# Altium project Manipulador.PrjPcb
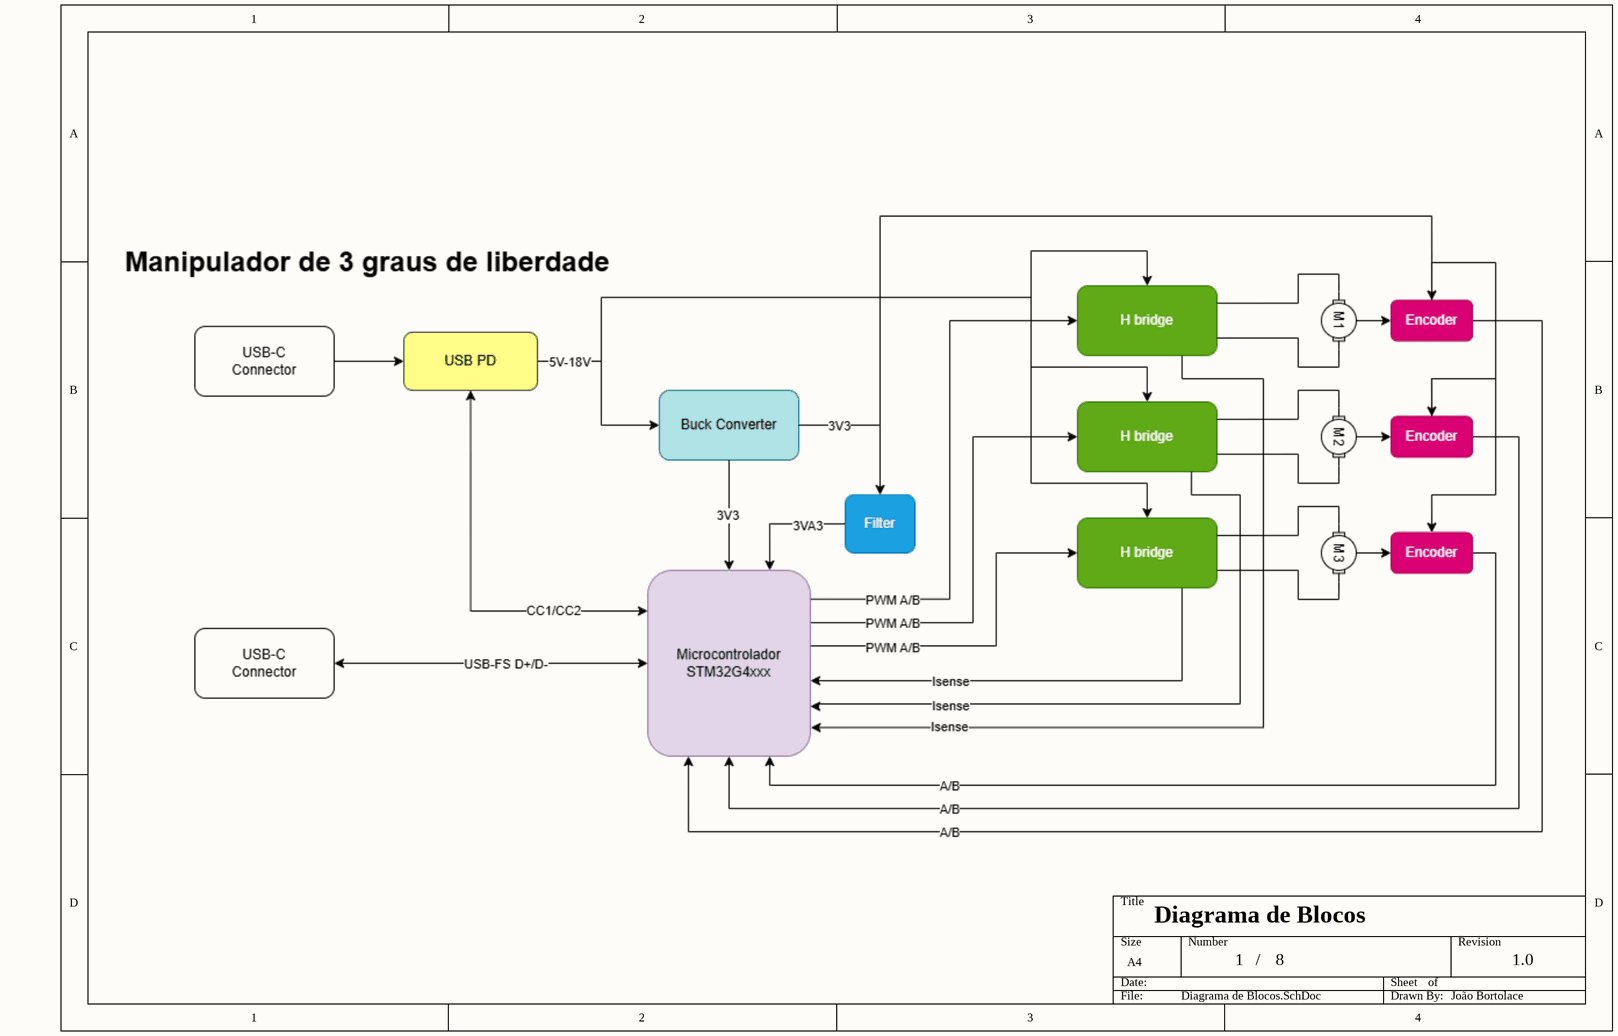
[diagram p0: Diagrama de Blocos.SchDoc]
6 sheets, 124 parts. Net scope: hierarchical (ports join the sheet entries above them; power ports are global).
Board file: Manipulador.PcbDoc
Sheets:
  Diagrama de Blocos.SchDoc
  Esquemático Principal.SchDoc
    PWR = Alimentação.SchDoc
    MCU = Microcontrolador.SchDoc
    M1 = Controle do Motor.SchDoc
    DATA = Conectores.SchDoc
    M2 = Controle do Motor.SchDoc
    M3 = Controle do Motor.SchDoc

## Sheet Diagrama de Blocos.SchDoc: Diagrama de Blocos
size A4; DrawnBy: João Bortolace; Revision: 1.0; SheetNumber: 1; SheetTotal: 8

### Notes on the sheet
- /

## Sheet Esquemático Principal.SchDoc: Esquemático Principal
size A4; DrawnBy: João Bortolace; Revision: 1.0; SheetNumber: 2; SheetTotal: 6
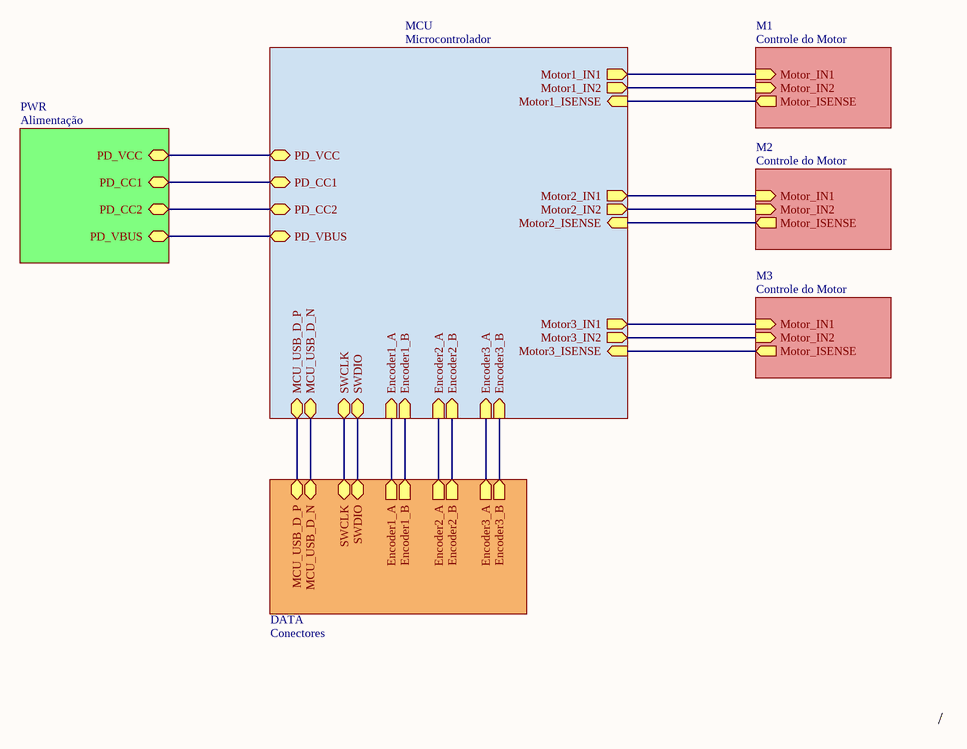
[diagram p1: Esquemático Principal.SchDoc]

### Sub-sheets
DATA = Conectores: MCU_USB_D_P (bidir), MCU_USB_D_N (bidir), SWCLK (bidir), SWDIO (bidir), Encoder1_A (out), Encoder1_B (out), Encoder2_B (out), Encoder2_A (out), Encoder3_A (out), Encoder3_B (out)
M1 = Controle do Motor: Motor_IN1 (in), Motor_IN2 (in), Motor_ISENSE (out)
M2 = Controle do Motor: Motor_IN1 (in), Motor_IN2 (in), Motor_ISENSE (out)
M3 = Controle do Motor: Motor_IN1 (in), Motor_IN2 (in), Motor_ISENSE (out)
MCU = Microcontrolador: PD_CC2 (bidir), PD_CC1 (bidir), PD_VCC (bidir), PD_VBUS (bidir), Motor1_IN1 (out), Motor1_IN2 (out), Motor1_ISENSE (in), Motor2_IN1 (out), Motor2_IN2 (out), Motor2_ISENSE (in), Motor3_IN1 (out), Motor3_IN2 (out), Motor3_ISENSE (in), MCU_USB_D_P (bidir), MCU_USB_D_N (bidir), Encoder1_A (in), Encoder1_B (in), Encoder2_B (in), Encoder2_A (in), Encoder3_A (in), Encoder3_B (in), SWCLK (bidir), SWDIO (bidir)
PWR = Alimentação: PD_CC2 (bidir), PD_CC1 (bidir), PD_VBUS (bidir), PD_VCC (bidir)

### Nets
Encoder1_A: sheet MCU/Encoder1_A, sheet DATA/Encoder1_A
Encoder1_B: sheet MCU/Encoder1_B, sheet DATA/Encoder1_B
Encoder2_A: sheet MCU/Encoder2_A, sheet DATA/Encoder2_A
Encoder2_B: sheet MCU/Encoder2_B, sheet DATA/Encoder2_B
Encoder3_A: sheet MCU/Encoder3_A, sheet DATA/Encoder3_A
Encoder3_B: sheet MCU/Encoder3_B, sheet DATA/Encoder3_B
MCU_USB_D_N: sheet MCU/MCU_USB_D_N, sheet DATA/MCU_USB_D_N
MCU_USB_D_P: sheet MCU/MCU_USB_D_P, sheet DATA/MCU_USB_D_P
Motor1_IN1: sheet MCU/Motor1_IN1, sheet M1/Motor_IN1
Motor1_IN2: sheet MCU/Motor1_IN2, sheet M1/Motor_IN2
Motor1_ISENSE: sheet MCU/Motor1_ISENSE, sheet M1/Motor_ISENSE
Motor2_IN1: sheet MCU/Motor2_IN1, sheet M2/Motor_IN1
Motor2_IN2: sheet MCU/Motor2_IN2, sheet M2/Motor_IN2
Motor2_ISENSE: sheet MCU/Motor2_ISENSE, sheet M2/Motor_ISENSE
Motor3_IN1: sheet MCU/Motor3_IN1, sheet M3/Motor_IN1
Motor3_IN2: sheet MCU/Motor3_IN2, sheet M3/Motor_IN2
Motor3_ISENSE: sheet MCU/Motor3_ISENSE, sheet M3/Motor_ISENSE
PD_CC1: sheet PWR/PD_CC1, sheet MCU/PD_CC1
PD_CC2: sheet PWR/PD_CC2, sheet MCU/PD_CC2
PD_VBUS: sheet PWR/PD_VBUS, sheet MCU/PD_VBUS
PD_VCC: sheet PWR/PD_VCC, sheet MCU/PD_VCC
SWCLK: sheet MCU/SWCLK, sheet DATA/SWCLK
SWDIO: sheet MCU/SWDIO, sheet DATA/SWDIO

### Notes on the sheet
- /

## Sheet Alimentação.SchDoc: Alimentação
size A4; DrawnBy: João Bortolace; Revision: 1.0; SheetNumber: 3; SheetTotal: 6
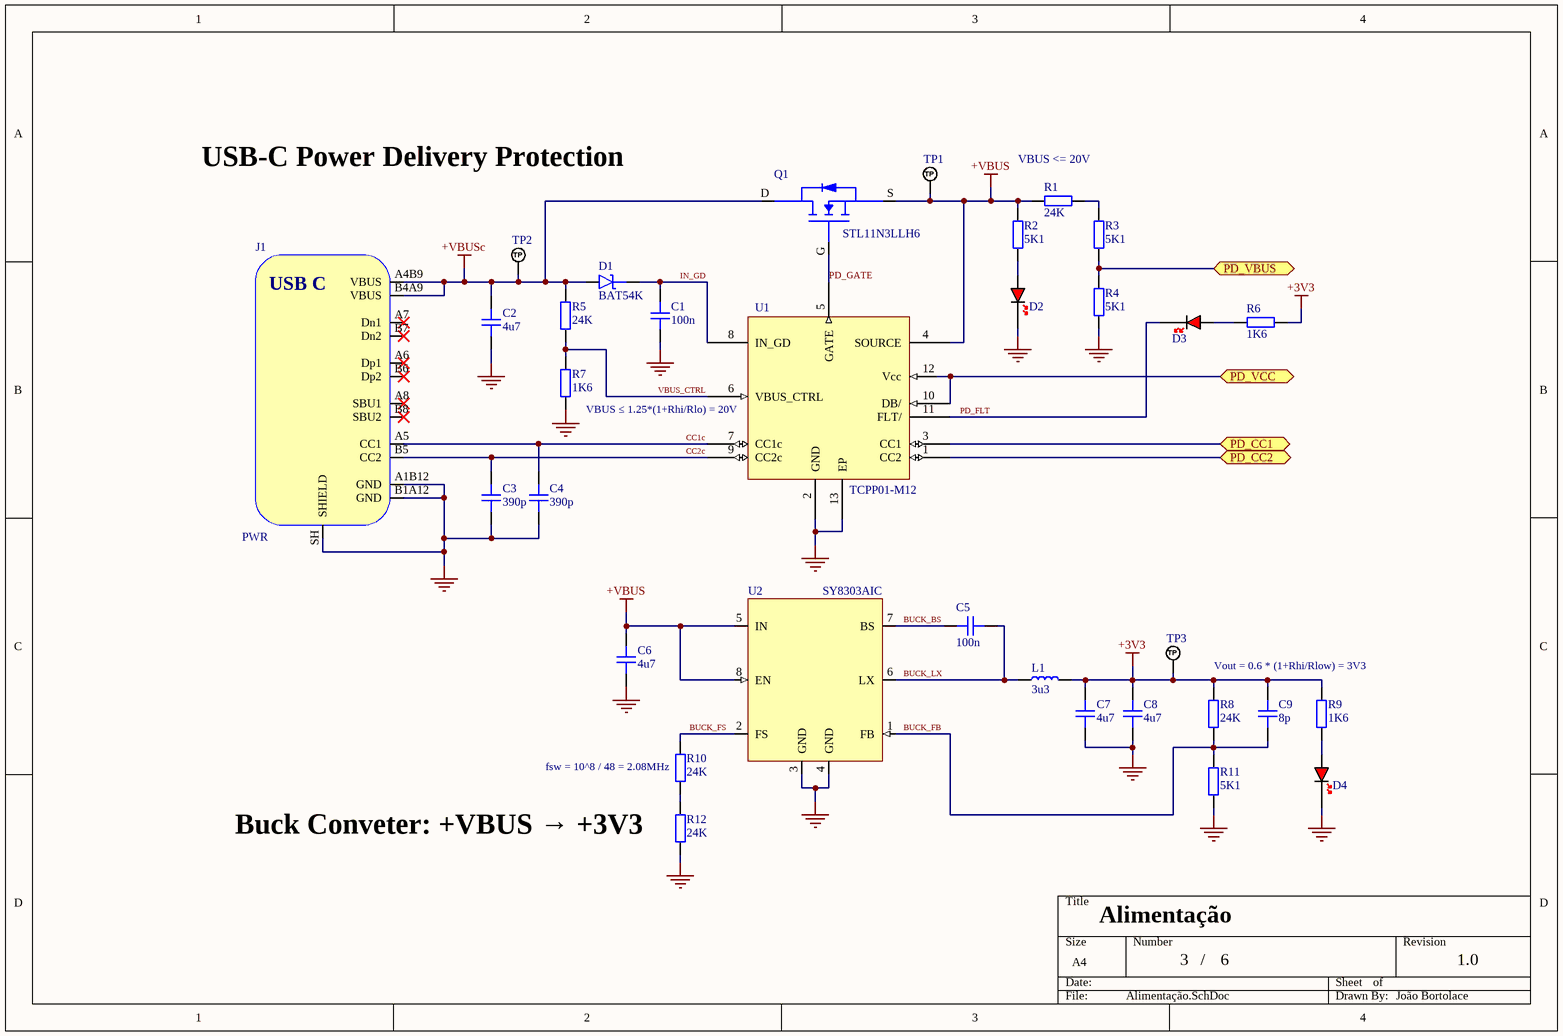
[diagram p2: Alimentação.SchDoc]

### Parts
C1  100n  [CAP_0402]
C2  4u7  [CAP_0805]
C3  390p  [CAP_0603]
C4  390p  [CAP_0603]
C5  100n  [CAP_0402]
C6  4u7  [CAP_0805]
C7  4u7  [CAP_0805]
C8  4u7  [CAP_0805]
C9  8p  [CAP_0402]
D1  BAT54K  [SOD-323]
D2  +VBUS  [LED_0402_RED]  (value not drawn)
D3  FLT  [LED_0402_RED]  (value not drawn)
D4  +3V3  [LED_0402_RED]  (value not drawn)
J1  PWR  [USB4105-GF-A-060]
L1  3u3  [SRP3212A]
Q1  STL11N3LLH6  [PowerFLAT 3.3x3.3]
R1  24K  [RES_0402]
R2  5K1  [RES_0402]
R3  5K1  [RES_0402]
R4  5K1  [RES_0402]
R5  24K  [RES_0402]
R6  1K6  [RES_0402]
R7  1K6  [RES_0402]
R8  24K  [RES_0402]
R9  1K6  [RES_0402]
R10  24K  [RES_0402]
R11  5K1  [RES_0402]
R12  24K  [RES_0402]
TP1  TP_NOBOM  [PAD_RND_1MM]  (value not drawn)  (no BOM)
TP2  TP_NOBOM  [PAD_RND_1MM]  (value not drawn)  (no BOM)
TP3  TP_NOBOM  [PAD_RND_1MM]  (value not drawn)  (no BOM)
U1  TCPP01-M12  [QFN-12L]
U2  SY8303AIC  [TSOT23-8]

### Ports
PD_CC1 (bidir, see Esquemático Principal[2B], Microcontrolador[1C]), PD_CC2 (bidir, see Esquemático Principal[2B], Microcontrolador[1B]), PD_VBUS (bidir, see Esquemático Principal[2B], Microcontrolador[3B]), PD_VCC (bidir, see Esquemático Principal[2B], Microcontrolador[1D])

### Nets
+3V3: C7.2 C8.2 C9.2 L1.2 R6.1 R8.2 R9.2 TP3.1(TP)
+VBUS: C6.2 Q1.S R1.2 R2.2 TP1.1(TP) U1.4(SOURCE) U2.5(IN) U2.8(EN)
+VBUSc: C2.2 D1.A J1.A4B9(VBUS) J1.B4A9(VBUS) Q1.D R5.2 TP2.1(TP)
GND: C1.1 C2.1 C3.1 C4.1 C6.1 C7.1 C8.1 D2.K D4.K J1.A1B12(GND) J1.B1A12(GND) J1.SH(SHIELD) R4.1 R7.1 R11.1 R12.1 U1.2(GND) U1.13(EP) U2.3(GND) U2.4(GND)
BUCK_BS: C5.1 U2.7(BS)
BUCK_FB: C9.1 R8.1 R11.2 U2.1(FB)
BUCK_FS: R10.2 U2.2(FS)
BUCK_LX: C5.2 L1.1 U2.6(LX)
CC1c: C4.2 J1.A5(CC1) U1.7(CC1c)
CC2c: C3.2 J1.B5(CC2) U1.9(CC2c)
IN_GD: C1.2 D1.K U1.8(IN_GD)
PD_CC1: U1.3(CC1) ; port PD_CC1
PD_CC2: U1.1(CC2) ; port PD_CC2
PD_FLT: D3.K U1.11(FLT/)
PD_GATE: Q1.G U1.5(GATE)
PD_VBUS: R3.2 R4.2 ; port PD_VBUS
PD_VCC: U1.10(DB/) U1.12(Vcc) ; port PD_VCC
VBUS_CTRL: R5.1 R7.2 U1.6(VBUS_CTRL)
NetD2_A: D2.A R2.1
NetD3_A: D3.A R6.2
NetD4_A: D4.A R9.1
NetR1_1: R1.1 R3.1
NetR10_1: R10.1 R12.2

Not connected (* = marked no-connect by the designer): J1 A6(Dp1)* A7(Dn1)* A8(SBU1)* B6(Dp2)* B7(Dn2)* B8(SBU2)*

### Notes on the sheet
- USB-C Power Delivery Protection
- VBUS <= 20V
- (near U1) VBUS ≤ 1.25*(1+Rhi/Rlo) = 20V
- Vout = 0.6 * (1+Rhi/Rlow) = 3V3
- (near R10) fsw = 10^8 / 48 = 2.08MHz
- Buck Conveter: +VBUS → +3V3
- /
- (in symbol USB4105-GF-A-060) USB C

### Library data of the parts
C1 C5 = CAP_0402: 100nF ±10% 50V Ceramic Capacitor X7R 0402D 0402; Manufacturer: muRata; Manufacturer Part Number: GRM155R71H104KE14D; Distributor Link: https://www.lcsc.com/product-detail/C77020.html; LCSC: C77020; Rating: *; Dielectric: *
C2 C6-C8 = CAP_0805: 4.7uF ±10% 50V Ceramic Capacitor X5R 0805; Manufacturer: Samsung Electro-Mechanics; Manufacturer Part Number: CL21A475KBQNNNE; Distributor Link: https://www.lcsc.com/product-detail/C98192.html?s_z=n_capacitor%25204.7u; LCSC: C98192; Rating: *; Dielectric: *
C3 C4 = CAP_0603: 390pF ±5% 50V Ceramic Capacitor C0G 0603; Manufacturer: muRata; Manufacturer Part Number: GRM1885C1H391JA01D; Distributor Link: https://www.lcsc.com/product-detail/C701309.html?s_z=n_C701309; LCSC: C701309; Rating: 50V; Dielectric: C0G
C9 = CAP_0402: 8pF ±1% 50V Ceramic Capacitor C0G 0402; Manufacturer: muRata; Manufacturer Part Number: GCM1555C1H8R0FA16D; Distributor Link: https://www.lcsc.com/product-detail/C1864375.html?utm_source=octopart&utm_medium=cpc&utm_campaign=GCM1555C1H8R0FA16D; LCSC: C1864375; Rating: 50V; Dielectric: C0G
D1 = D_SCHOTTKY_SOD_323: Diode Schottky SMD SOD-323; Manufacturer: STMicroelectronics; Manufacturer Part Number: BAT54KFILM; Part Link: https://www.lcsc.com/product-detail/C283259.html?s_z=n_BAT54K; LCSC: C283259
D2-D4 = LED_0402_RED: LED 0402 RED SMD
J1 = USB4105-GF-A-060: USB-C (USB TYPE-C) Receptacle Connector 16 Position Surface Mount, Right Angle; Manufacturer: DEALON; Manufacturer Part Number: USB-TYPE-C-018; Part Link: https://www.lcsc.com/product-detail/C2927038.html?s_z=n_usb%2520type%2520c; LCSC: C2927038
L1 = SRP3212A-*: Inductor 3u3 3.4A  87mΩ 1210 Fixed Inductors RoHS; Manufacturer: Bourns; Manufacturer Part Number: SRP3212A-3R3M; Distributor Link: https://www.lcsc.com/product-detail/C19779117.html?s_z=n_SRP3212A-%2a; LCSC: C19779117
Q1 = STL11N3LLH6: Mosfet N-channel 30 V, 6 mΩ typ., 11 A; Manufacturer: STMicroelectronics; Manufacturer Part Number: STL11N3LLH6; Part Link: https://www.mouser.com/ProductDetail/STMicroelectronics/STL11N3LLH6?qs=CBOTe0%252BbgkbnVaR%2FX25%2FKw%3D%3D; LCSC: C2965326
R1-R12 = RES_0402: Resistor SMD 0402; Manufacturer: *; Manufacturer Part Number: *; Distributor Link: *; LCSC: *
TP1-TP3 = TEST_POINT_RND_1MM: Test Point Round 1mm (NO BOM)
U1 = TCPP01-M12: USB Type-C™ and power delivery protection for sink application; Manufacturer: STMicroelectronics; Manufacturer Part Number: TCPP01-M12; ComponentLink1Description: Datasheet; ComponentLink1URL: *; Part Link: https://www.mouser.com/ProductDetail/STMicroelectronics/TCPP01-M12?qs=%252B6g0mu59x7KCafIwapwG2A%3D%3D; LCSC: C1121848; Mouser: 511-TCPP01-M12
U2 = SY8303AIC: High Efficiency Fast Response, 3A, 40V Input Synchronous Step Down Regulator; Manufacturer: Silergy; Manufacturer Part Number: SY8303AIC; Distributor Link: https://www.lcsc.com/product-detail/DC-DC-Converters_Silergy-Corp-SY8303AIC_C97054.html; LCSC: C97054

## Sheet Microcontrolador.SchDoc: Microcontrolador
size A4; DrawnBy: João Bortolace; Revision: 1.0; SheetNumber: 4; SheetTotal: 6
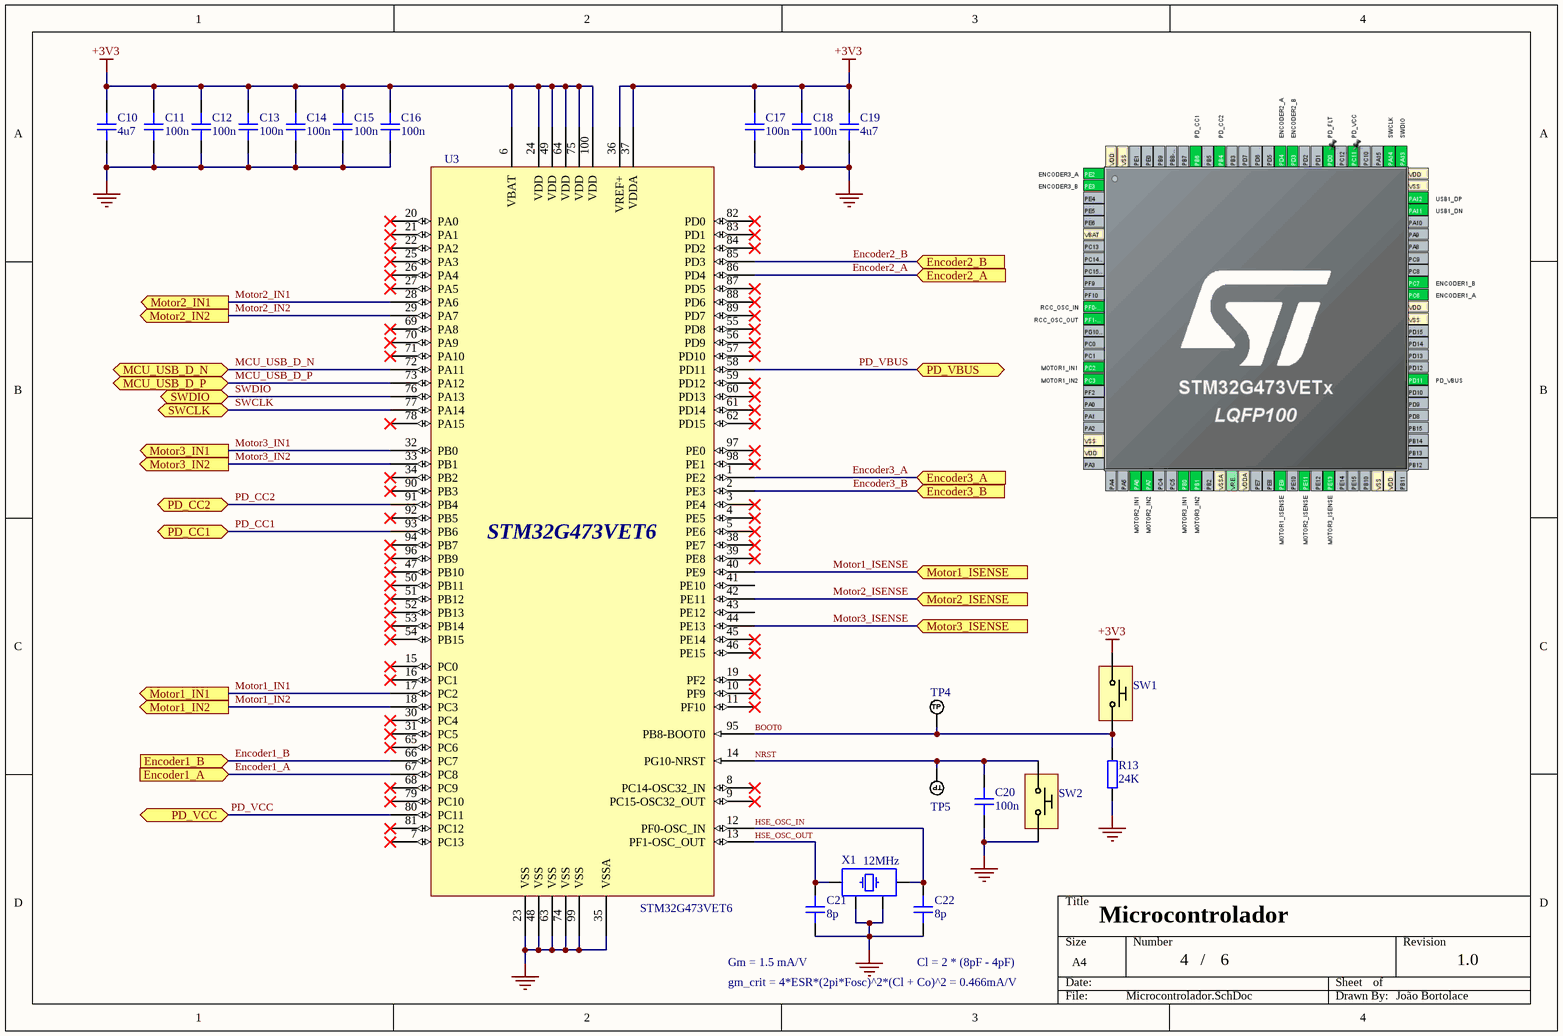
[diagram p3: Microcontrolador.SchDoc]

### Parts
C10  4u7  [CAP_0805]
C11  100n  [CAP_0402]
C12  100n  [CAP_0402]
C13  100n  [CAP_0402]
C14  100n  [CAP_0402]
C15  100n  [CAP_0402]
C16  100n  [CAP_0402]
C17  100n  [CAP_0402]
C18  100n  [CAP_0402]
C19  4u7  [CAP_0805]
C20  100n  [CAP_0402]
C21  8p  [CAP_0402]
C22  8p  [CAP_0402]
R13  24K  [RES_0402]
SW1  BOOT  [PTS815]  (value not drawn)
SW2  RST  [PTS815]  (value not drawn)
TP4  TP_NOBOM  [PAD_RND_1MM]  (value not drawn)  (no BOM)
TP5  TP_NOBOM  [PAD_RND_1MM]  (value not drawn)  (no BOM)
U3  STM32G473VET6  [LQFP100]
X1  12MHz  [XTAL_3225]

### Ports
Encoder1_A (in, see Esquemático Principal[2C], Conectores[1C]), Encoder1_B (in, see Esquemático Principal[2C], Conectores[1D]), Encoder2_A (in, see Esquemático Principal[2C], Conectores[2C]), Encoder2_B (in, see Esquemático Principal[2C], Conectores[2D]), Encoder3_A (in, see Esquemático Principal[2C], Conectores[3C]), Encoder3_B (in, see Esquemático Principal[2C], Conectores[3D]), MCU_USB_D_N (bidir, see Esquemático Principal[2C], Conectores[3B]), MCU_USB_D_P (bidir, see Esquemático Principal[2C], Conectores[3B]), Motor1_IN1 (out, see Esquemático Principal[3B]), Motor1_IN2 (out, see Esquemático Principal[3B]), Motor1_ISENSE (in, see Esquemático Principal[3B]), Motor2_IN1 (out, see Esquemático Principal[3B]), Motor2_IN2 (out, see Esquemático Principal[3B]), Motor2_ISENSE (in, see Esquemático Principal[3B]), Motor3_IN1 (out, see Esquemático Principal[3C]), Motor3_IN2 (out, see Esquemático Principal[3C]), Motor3_ISENSE (in, see Esquemático Principal[3C]), PD_CC1 (bidir, see Esquemático Principal[2B], Alimentação[4B]), PD_CC2 (bidir, see Esquemático Principal[2B], Alimentação[4B]), PD_VBUS (bidir, see Esquemático Principal[2B], Alimentação[4B]), PD_VCC (bidir, see Esquemático Principal[2B], Alimentação[4B]), SWCLK (bidir, see Esquemático Principal[2C], Conectores[3B]), SWDIO (bidir, see Esquemático Principal[2C], Conectores[3B])

### Nets
+3V3: C10.2 C11.2 C12.2 C13.2 C14.2 C15.2 C16.2 C17.2 C18.2 C19.2 SW1.1 U3.6(VBAT) U3.24(VDD) U3.36(VREF+) U3.37(VDDA) U3.49(VDD) U3.64(VDD) U3.75(VDD) U3.100(VDD)
GND: C10.1 C11.1 C12.1 C13.1 C14.1 C15.1 C16.1 C17.1 C18.1 C19.1 C20.1 C21.1 C22.1 R13.1 SW2.2 U3.23(VSS) U3.35(VSSA) U3.48(VSS) U3.63(VSS) U3.74(VSS) U3.99(VSS) X1.2 X1.4
BOOT0: R13.2 SW1.2 TP4.1(TP) U3.95(PB8-BOOT0)
Encoder1_A: U3.67(PC8) ; port Encoder1_A
Encoder1_B: U3.66(PC7) ; port Encoder1_B
Encoder2_A: U3.86(PD4) ; port Encoder2_A
Encoder2_B: U3.85(PD3) ; port Encoder2_B
Encoder3_A: U3.1(PE2) ; port Encoder3_A
Encoder3_B: U3.2(PE3) ; port Encoder3_B
HSE_OSC_IN: C22.2 U3.12(PF0-OSC_IN) X1.3
HSE_OSC_OUT: C21.2 U3.13(PF1-OSC_OUT) X1.1
MCU_USB_D_N: U3.72(PA11) ; port MCU_USB_D_N
MCU_USB_D_P: U3.73(PA12) ; port MCU_USB_D_P
Motor1_IN1: U3.17(PC2) ; port Motor1_IN1
Motor1_IN2: U3.18(PC3) ; port Motor1_IN2
Motor1_ISENSE: U3.40(PE9) ; port Motor1_ISENSE
Motor2_IN1: U3.28(PA6) ; port Motor2_IN1
Motor2_IN2: U3.29(PA7) ; port Motor2_IN2
Motor2_ISENSE: U3.42(PE11) ; port Motor2_ISENSE
Motor3_IN1: U3.32(PB0) ; port Motor3_IN1
Motor3_IN2: U3.33(PB1) ; port Motor3_IN2
Motor3_ISENSE: U3.44(PE13) ; port Motor3_ISENSE
NRST: C20.2 SW2.1 TP5.1(TP) U3.14(PG10-NRST)
PD_CC1: U3.93(PB6) ; port PD_CC1
PD_CC2: U3.91(PB4) ; port PD_CC2
PD_VBUS: U3.58(PD11) ; port PD_VBUS
PD_VCC: U3.80(PC11) ; port PD_VCC
SWCLK: U3.77(PA14) ; port SWCLK
SWDIO: U3.76(PA13) ; port SWDIO

Not connected (* = marked no-connect by the designer): U3 3(PE4)* 4(PE5)* 5(PE6)* 7(PC13)* 8(PC14-OSC32_IN)* 9(PC15-OSC32_OUT)* 10(PF9)* 11(PF10)* 15(PC0)* 16(PC1)* 19(PF2)* 20(PA0)* 21(PA1)* 22(PA2)* 25(PA3)* 26(PA4)* 27(PA5)* 30(PC4)* 31(PC5)* 34(PB2)* 38(PE7)* 39(PE8)* 41(PE10) 43(PE12) 45(PE14)* 46(PE15)* 47(PB10)* 50(PB11)* 51(PB12)* 52(PB13)* 53(PB14)* 54(PB15)* 55(PD8)* 56(PD9)* 57(PD10)* 59(PD12)* 60(PD13)* 61(PD14)* 62(PD15)* 65(PC6)* 68(PC9)* 69(PA8)* 70(PA9)* 71(PA10)* 78(PA15)* 79(PC10)* 81(PC12)* 82(PD0)* 83(PD1)* 84(PD2)* 87(PD5)* 88(PD6)* 89(PD7)* 90(PB3)* 92(PB5)* 94(PB7)* 96(PB9)* 97(PE0)* 98(PE1)*

### Notes on the sheet
- gm_crit = 4*ESR*(2pi*Fosc)^2*(Cl + Co)^2 = 0.466mA/V
- (near C21) Gm = 1.5 mA/V
- (near C22) Cl = 2 * (8pF - 4pF)
- /

### Library data of the parts
C10 C19 = CAP_0805: as C2 on sheet Alimentação; Distributor Link: https://www.lcsc.com/product-detail/C98192.html?s_z=n_capacitor%25204.7u; LCSC: C98192; Rating: *; Dielectric: *
C11-C18 C20 = CAP_0402: as C1 on sheet Alimentação; Distributor Link: https://www.lcsc.com/product-detail/C77020.html; LCSC: C77020; Rating: *; Dielectric: *
  C17: Supplier: LCSC; Supplier Part Number: C730122
C21 C22 = CAP_0402: as C9 on sheet Alimentação; Distributor Link: https://www.lcsc.com/product-detail/C1864375.html?utm_source=octopart&utm_medium=cpc&utm_campaign=GCM1555C1H8R0FA16D; LCSC: C1864375; Rating: 50V; Dielectric: C0G
R13 = RES_0402: Resistor SMD 0402; Manufacturer: *; Manufacturer Part Number: *; Distributor Link: *; LCSC: *
SW1 SW2 = PTS815-SJM-250-SMTR-LFS: Tactile Switch SPST 400gf 2.5mm 4.2mm x 3.2mm Surface Mount; Manufacturer: G-Switch; Manufacturer Part Number: GT-TC048D-H025-L1; LCSC: C843674
TP4 TP5 = TEST_POINT_RND_1MM: Test Point Round 1mm (NO BOM)
U3 = STM32G473VET6: Arm Cortex-M4 32-bit MCU+FPU, up to 512 KB Flash, 170 MHz / 213DMIPS, 128KB SRAM, rich analog, math accelerator; Manufacturer: STMicroelectronics; Manufacturer Part Number: STM32G473VET6; Part Link: https://www.lcsc.com/product-detail/C730122.html?s_z=n_C730122; LCSC: C730122; Supplier: Avnet; Supplier Part Number: STM32G473VET6
X1 = TSX-3225_24.0000MF15X-AC: Crystal 12MHz ±15ppm 8pF 120Ω SMD3225-4P; Manufacturer: DIODES; Manufacturer Part Number: FL1200138; LCSC: C526612; Part Link: https://www.lcsc.com/product-detail/C526612.html?s_z=n_Crystal%252012MHz%2520%25C2%25B110ppm%25208pF%2520120%25CE%25A9%2520SMD3225-4P; Supplier: LCSC; Supplier Part Number: C730122

## Sheet Controle do Motor.SchDoc: Controle do Motor
size A4; DrawnBy: João Bortolace; Revision: 1.0; SheetNumber: 5; SheetTotal: 6
Used 3 times, as channels M1, M2, M3. Parts and nets are listed once, with the designators drawn on the sheet.
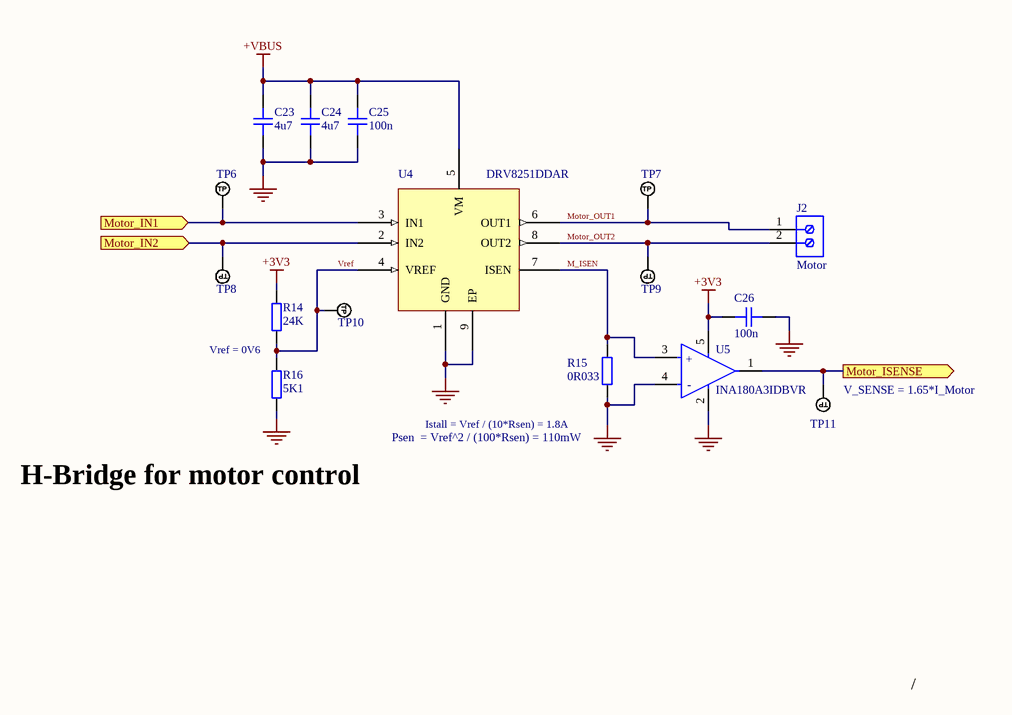
[diagram p4: Controle do Motor.SchDoc]

### Parts
C23  4u7  [CAP_0805]
C24  4u7  [CAP_0805]
C25  100n  [CAP_0402]
C26  100n  [CAP_0402]
J2  Motor  [691102710002]  (no BOM)
R14  24K  [RES_0402]
R15  0R033  [RES_1206]
R16  5K1  [RES_0402]
TP6  TP_NOBOM  [PAD_RND_1MM]  (value not drawn)  (no BOM)
TP7  TP_NOBOM  [PAD_RND_1MM]  (value not drawn)  (no BOM)
TP8  TP_NOBOM  [PAD_RND_1MM]  (value not drawn)  (no BOM)
TP9  TP_NOBOM  [PAD_RND_1MM]  (value not drawn)  (no BOM)
TP10  TP_NOBOM  [PAD_RND_1MM]  (value not drawn)  (no BOM)
TP11  TP_NOBOM  [PAD_RND_1MM]  (value not drawn)  (no BOM)
U4  DRV8251DDAR  [HSOP8]
U5  INA180A3IDBVR  [FP-DBV0005A-MFG]

### Ports
Motor_IN1 (in, see Esquemático Principal[3B]), Motor_IN2 (in, see Esquemático Principal[3B]), Motor_ISENSE (out, see Esquemático Principal[3B])

### Nets
+3V3: C26.2 R14.2 U5.5(VS)
+VBUS: C23.2 C24.2 C25.2 U4.5(VM)
GND: C23.1 C24.1 C25.1 C26.1 R15.1 R16.1 U4.1(GND) U4.9(EP) U5.2(GND) U5.4(IN-)
M_ISEN: R15.2 U4.7(ISEN) U5.3(IN+)
Motor_IN1: TP6.1(TP) U4.3(IN1) ; port Motor_IN1
Motor_IN2: TP8.1(TP) U4.2(IN2) ; port Motor_IN2
Motor_ISENSE: TP11.1(TP) U5.1(OUT) ; port Motor_ISENSE
Motor_OUT1: J2.1 TP7.1(TP) U4.6(OUT1)
Motor_OUT2: J2.2 TP9.1(TP) U4.8(OUT2)
Vref: R14.1 R16.2 TP10.1(TP) U4.4(VREF)

### Channels
M1: designators end in A; ports Motor_IN1=Motor1_IN1 Motor_IN2=Motor1_IN2 Motor_ISENSE=Motor1_ISENSE
M2: designators end in B; ports Motor_IN1=Motor2_IN1 Motor_IN2=Motor2_IN2 Motor_ISENSE=Motor2_ISENSE
M3: designators end in C; ports Motor_IN1=Motor3_IN1 Motor_IN2=Motor3_IN2 Motor_ISENSE=Motor3_ISENSE

### Notes on the sheet
- Vref = 0V6
- (near R15) Psen  = Vref^2 / (100*Rsen) = 110mW
- (near R15) Istall = Vref / (10*Rsen) = 1.8A
- (near TP11) V_SENSE = 1.65*I_Motor
- H-Bridge for motor control
- /
- (in symbol CMP-04895-000229-1) +; -

### Library data of the parts
C23 C24 = CAP_0805: as C2 on sheet Alimentação; Distributor Link: https://www.lcsc.com/product-detail/C98192.html?s_z=n_capacitor%25204.7u; LCSC: C98192; Rating: *; Dielectric: *
C25 C26 = CAP_0402: as C1 on sheet Alimentação; Distributor Link: https://www.lcsc.com/product-detail/C77020.html; LCSC: C77020; Rating: *; Dielectric: *
J2 = CMP-1502-03258-3: 102 Series 5MM Pitch Straight, Pcb Terminal Block, Through Hole, 2 Way; Current Rating: 15A; Wire/Cable Gauge: 22AWG; Voltage: 300V; Number of Positions Per Level: 2; Plating: Steel; Stripping Length: -6mm; Wire Gauge (Min): 14AWG; Number of Levels: 1; Pitch: 5.0038mm; Width: 11.2mm; Max Operating Temperature: 105°C; Contact Material: Brass; Contact Plating: Tin; Current: 15A; Wire Gauge (Max): 22AWG; Mount: Through Hole; Length: 7.5mm; Min Operating Temperature: -40°C; RoHS: Compliant; Color: Blue; Number of Pins: 2; Housing Material: Nylon; Termination: Screw; Height: 13.4mm; Number of Contacts: 2; Lead Pitch: 5mm; Voltage Rating: 300V; Packaging: Box
R14 R16 = RES_0402: Resistor SMD 0402; Manufacturer: *; Manufacturer Part Number: *; Distributor Link: *; LCSC: *
R15 = RES_1206: 250mW 33mΩ Thick Film Resistor ±1200ppm/℃ ±1% 1206 Chip Resistor - Surface Mount RoHS; Manufacturer: FOJAN; Manufacturer Part Number: FRL1206FR033TS; Distributor Link: https://www.lcsc.com/product-detail/C7467307.html?s_z=n_33m%25CE%25A9%2520; LCSC: C7467307
TP6-TP11 = TEST_POINT_RND_1MM: Test Point Round 1mm (NO BOM)
U4 = DRV8251: 4.1-A Brushed DC Motor Driver with Integrated Current Regulation; Manufacturer: TI; Manufacturer Part Number: DRV8251DDAR; Part Link: https://www.lcsc.com/product-detail/C3681116.html?s_z=n_C3681116; LCSC: C3681116; Mouser: 595-DRV8251DDAR
U5 = CMP-04895-000229-1: IC CURR SENSE 1 CIRCUIT SOT23-5; -3db Bandwidth: 350kHz; Input Bias Current: 100nA; Input Offset Voltage (Vos): 100uV; Operating Supply Current: 260uA; Slew Rate: 2V/µs; Number of Circuits: 1; Max Operating Temperature: 125°C; Packaging: Tape and Reel; Case/Package: SOT-23-5; Mount: Surface Mount; Min Operating Temperature: -40°C; RoHS Compliant: Yes

## Sheet Conectores.SchDoc: Conectores
size A4; DrawnBy: João Bortolace; Revision: 1.0; SheetNumber: 6; SheetTotal: 6
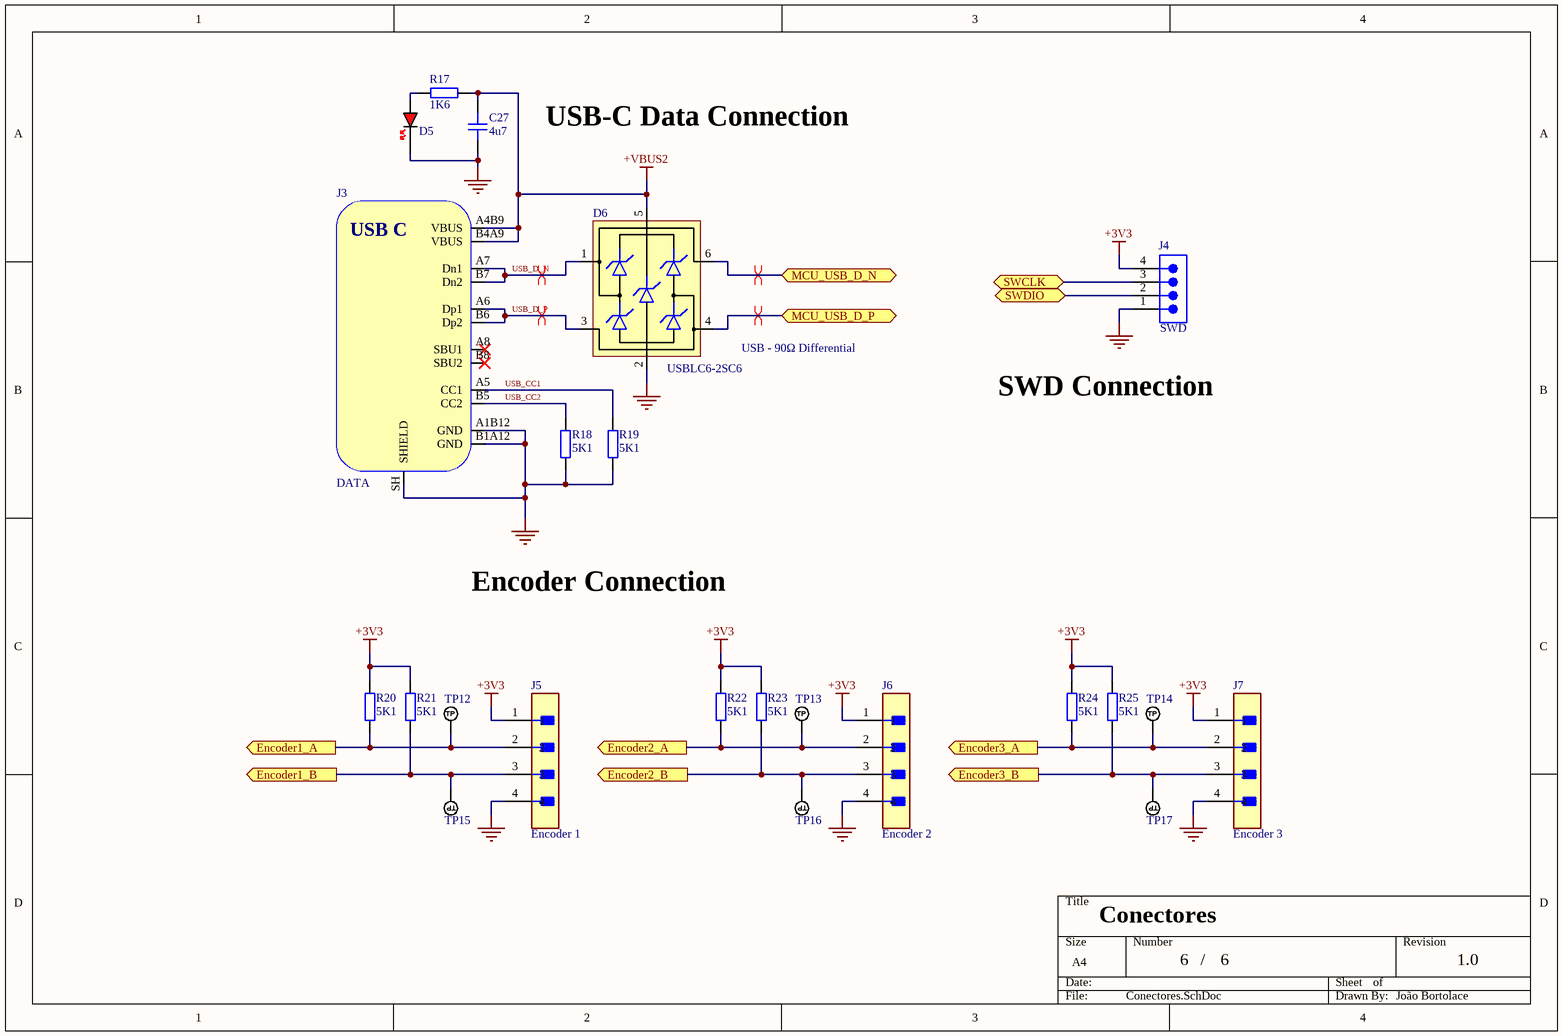
[diagram p5: Conectores.SchDoc]

### Parts
C27  4u7  [CAP_0805]
D5  USB  [LED_0402_RED]  (value not drawn)
D6  USBLC6-2SC6  [SOT-23-6]
J3  DATA  [USB4105-GF-A-060]
J4  SWD  [SMTC-PHT-104-01-X-S]  (no BOM)
J5  Encoder 1  [FP-470531000-MFG]  (no BOM)
J6  Encoder 2  [FP-470531000-MFG]  (no BOM)
J7  Encoder 3  [FP-470531000-MFG]  (no BOM)
R17  1K6  [RES_0402]
R18  5K1  [RES_0603]
R19  5K1  [RES_0603]
R20  5K1  [RES_0402]
R21  5K1  [RES_0402]
R22  5K1  [RES_0402]
R23  5K1  [RES_0402]
R24  5K1  [RES_0402]
R25  5K1  [RES_0402]
TP12  TP_NOBOM  [PAD_RND_1MM]  (value not drawn)  (no BOM)
TP13  TP_NOBOM  [PAD_RND_1MM]  (value not drawn)  (no BOM)
TP14  TP_NOBOM  [PAD_RND_1MM]  (value not drawn)  (no BOM)
TP15  TP_NOBOM  [PAD_RND_1MM]  (value not drawn)  (no BOM)
TP16  TP_NOBOM  [PAD_RND_1MM]  (value not drawn)  (no BOM)
TP17  TP_NOBOM  [PAD_RND_1MM]  (value not drawn)  (no BOM)

### Ports
Encoder1_A (out, see Esquemático Principal[2C], Microcontrolador[1D]), Encoder1_B (out, see Esquemático Principal[2C], Microcontrolador[1C]), Encoder2_A (out, see Esquemático Principal[2C], Microcontrolador[3B]), Encoder2_B (out, see Esquemático Principal[2C], Microcontrolador[3B]), Encoder3_A (out, see Esquemático Principal[2C], Microcontrolador[3B]), Encoder3_B (out, see Esquemático Principal[2C], Microcontrolador[3B]), MCU_USB_D_N (bidir, see Esquemático Principal[2C], Microcontrolador[1B]), MCU_USB_D_P (bidir, see Esquemático Principal[2C], Microcontrolador[1B]), SWCLK (bidir, see Esquemático Principal[2C], Microcontrolador[1B]), SWDIO (bidir, see Esquemático Principal[2C], Microcontrolador[1B])

### Nets
+3V3: J4.4 J5.1 J6.1 J7.1 R20.2 R21.2 R22.2 R23.2 R24.2 R25.2
+VBUS2: C27.2 D6.5(VBUS) J3.A4B9(VBUS) J3.B4A9(VBUS) R17.2
GND: C27.1 D5.K D6.2(GND) J3.A1B12(GND) J3.B1A12(GND) J3.SH(SHIELD) J4.1 J5.4 J6.4 J7.4 R18.1 R19.1
Encoder1_A: J5.2 R20.1 TP12.1(TP) ; port Encoder1_A
Encoder1_B: J5.3 R21.1 TP15.1(TP) ; port Encoder1_B
Encoder2_A: J6.2 R22.1 TP13.1(TP) ; port Encoder2_A
Encoder2_B: J6.3 R23.1 TP16.1(TP) ; port Encoder2_B
Encoder3_A: J7.2 R24.1 TP14.1(TP) ; port Encoder3_A
Encoder3_B: J7.3 R25.1 TP17.1(TP) ; port Encoder3_B
MCU_USB_D_N: D6.6(IO1) ; port MCU_USB_D_N
MCU_USB_D_P: D6.4(IO2) ; port MCU_USB_D_P
SWCLK: J4.3 ; port SWCLK
SWDIO: J4.2 ; port SWDIO
USB_CC1: J3.A5(CC1) R19.2
USB_CC2: J3.B5(CC2) R18.2
USB_D_N: D6.1(IO1) J3.A7(Dn1) J3.B7(Dn2)
USB_D_P: D6.3(IO2) J3.A6(Dp1) J3.B6(Dp2)
NetD5_A: D5.A R17.1

Not connected (* = marked no-connect by the designer): J3 A8(SBU1)* B8(SBU2)*

### Layout directives
differential pair: USB_D_N, USB_D_P
differential pair; net class USB_DIFF: MCU_USB_D_N, MCU_USB_D_P

### Notes on the sheet
- USB-C Data Connection
- (near D6) USB - 90Ω Differential
- SWD Connection
- Encoder Connection
- /
- (in symbol USB4105-GF-A-060) USB C

### Library data of the parts
C27 = CAP_0805: as C2 on sheet Alimentação; Distributor Link: https://www.lcsc.com/product-detail/C98192.html?s_z=n_capacitor%25204.7u; LCSC: C98192; Rating: *; Dielectric: *
D5 = LED_0402_RED: LED 0402 RED SMD
D6 = USBLC6-2SC6: Low-Capacitance ESD Protection USB; Manufacturer: STMicroelectronics; Manufacturer Part Number: USBLC6-2SC6; Distributor Link: https://www.mouser.de/ProductDetail/STMicroelectronics/USBLC6-2SC6?qs=po45yt2pPpu%2FhNIlwQdTlg%3D%3D; LCSC: C7519
J3 = USB4105-GF-A-060: as J1 on sheet Alimentação; Part Link: https://www.lcsc.com/product-detail/C2927038.html?s_z=n_usb%2520type%2520c; LCSC: C2927038
J4 = CMP-1024-00182-1: Press Fit Header, Through-hole, Vertical, -55 to 125 degC, 2.54 mm Pitch, 4-Pin, Male, RoHS; Manufacturer: Samtec; PartNumber: PHT-104-01-L-S; Pitch: 2.54 mm; PackageDescription: .100 Press Fit Socket Assembly; ComponentLink2URL: http://www.samtec.com/documents/webfiles/pdf/pht.pdf; ComponentLink3Description: Package Specification; Temperature Range: -55 to 125 degC; ComponentLink1URL: http://www.samtec.com; Orientation: Vertical; ComponentLink1Description: Manufacturer URL; RoHS: True; DatasheetVersion: F-214; Mounting Technology: Through-hole; PackageReference: PHT-104-01-X-S; ComponentLink2Description: Datasheet; ComponentLink3URL: http://www.samtec.com/documents/webfiles/cpdf/PHT-1XX-XX-X-X-XXX-MKT.pdf; PackageVersion: J, 9/2009
J5-J7 = CMP-04776-000290-2: CONN HEADER VERT 4POS 2.54MM; NexarPartId: 854935; Manufacturer Lifecycle Status: ACTIVE; Voltage Rating (DC): 250V; Gender: Male; Plating: Copper; Number of Positions: 4; Glow Wire Compliant: Non-compliant; Current Rating: 500mA; Max Operating Temperature: 75°C; Number of Rows: 1; REACH SVHC: Unknown; Ambient Temperature Range High: 105°C; Pitch: 2.54mm; Height: 7.7mm; Min Operating Temperature: 0°C; Packaging: Bulk; Contact Material: Brass, Copper; Contact Plating: Tin; Lead Pitch: 2.54mm; Voltage Rating: 250V; Termination: Through Hole; Radiation Hardening: No; Orientation: Vertical; Mount: Through Hole; Number of Pins: 4; Country of Origin: HK; Halogen Free: Low Halogen; Lifecycle Status: Production; Number of Circuits: 4; Schedule B: 8536694040, 8536694040; Housing Color: Beige; Housing Material: Nylon; Depth: 5.84mm; RoHS: Compliant; Length: 10.2mm; Number of Contacts: 4
R17 R20-R25 = RES_0402: Resistor SMD 0402; Manufacturer: *; Manufacturer Part Number: *; Distributor Link: *; LCSC: *
R18 R19 = RES_0603: Resistor SMD 0603; Manufacturer: *; Manufacturer Part Number: *; Distributor Link: *; LCSC: *
TP12-TP17 = TEST_POINT_RND_1MM: Test Point Round 1mm (NO BOM)

## Nets that join several sheets
+3V3: Alimentação (8 pins), Microcontrolador (19 pins), M1 (C26A.2 R14A.2 U5A.5), Conectores (10 pins), M2 (C26B.2 R14B.2 U5B.5), M3 (C26C.2 R14C.2 U5C.5)
+VBUS: Alimentação (8 pins), M1 (C23A.2 C24A.2 C25A.2 U4A.5), M2 (C23B.2 C24B.2 C25B.2 U4B.5), M3 (C23C.2 C24C.2 C25C.2 U4C.5)
GND: Alimentação (20 pins), Microcontrolador (23 pins), M1 (10 pins), Conectores (12 pins), M2 (10 pins), M3 (10 pins)
Encoder1_A: Microcontrolador (U3.67), Conectores (J5.2 R20.1 TP12.1)
Encoder1_B: Microcontrolador (U3.66), Conectores (J5.3 R21.1 TP15.1)
Encoder2_A: Microcontrolador (U3.86), Conectores (J6.2 R22.1 TP13.1)
Encoder2_B: Microcontrolador (U3.85), Conectores (J6.3 R23.1 TP16.1)
Encoder3_A: Microcontrolador (U3.1), Conectores (J7.2 R24.1 TP14.1)
Encoder3_B: Microcontrolador (U3.2), Conectores (J7.3 R25.1 TP17.1)
MCU_USB_D_N: Microcontrolador (U3.72), Conectores (D6.6)
MCU_USB_D_P: Microcontrolador (U3.73), Conectores (D6.4)
Motor1_IN1: Microcontrolador (U3.17), M1 (TP6A.1 U4A.3)
Motor1_IN2: Microcontrolador (U3.18), M1 (TP8A.1 U4A.2)
Motor1_ISENSE: Microcontrolador (U3.40), M1 (TP11A.1 U5A.1)
Motor2_IN1: Microcontrolador (U3.28), M2 (TP6B.1 U4B.3)
Motor2_IN2: Microcontrolador (U3.29), M2 (TP8B.1 U4B.2)
Motor2_ISENSE: Microcontrolador (U3.42), M2 (TP11B.1 U5B.1)
Motor3_IN1: Microcontrolador (U3.32), M3 (TP6C.1 U4C.3)
Motor3_IN2: Microcontrolador (U3.33), M3 (TP8C.1 U4C.2)
Motor3_ISENSE: Microcontrolador (U3.44), M3 (TP11C.1 U5C.1)
PD_CC1: Alimentação (U1.3), Microcontrolador (U3.93)
PD_CC2: Alimentação (U1.1), Microcontrolador (U3.91)
PD_VBUS: Alimentação (R3.2 R4.2), Microcontrolador (U3.58)
PD_VCC: Alimentação (U1.10 U1.12), Microcontrolador (U3.80)
SWCLK: Microcontrolador (U3.77), Conectores (J4.3)
SWDIO: Microcontrolador (U3.76), Conectores (J4.2)